# Altium project power-hub.prjpcb
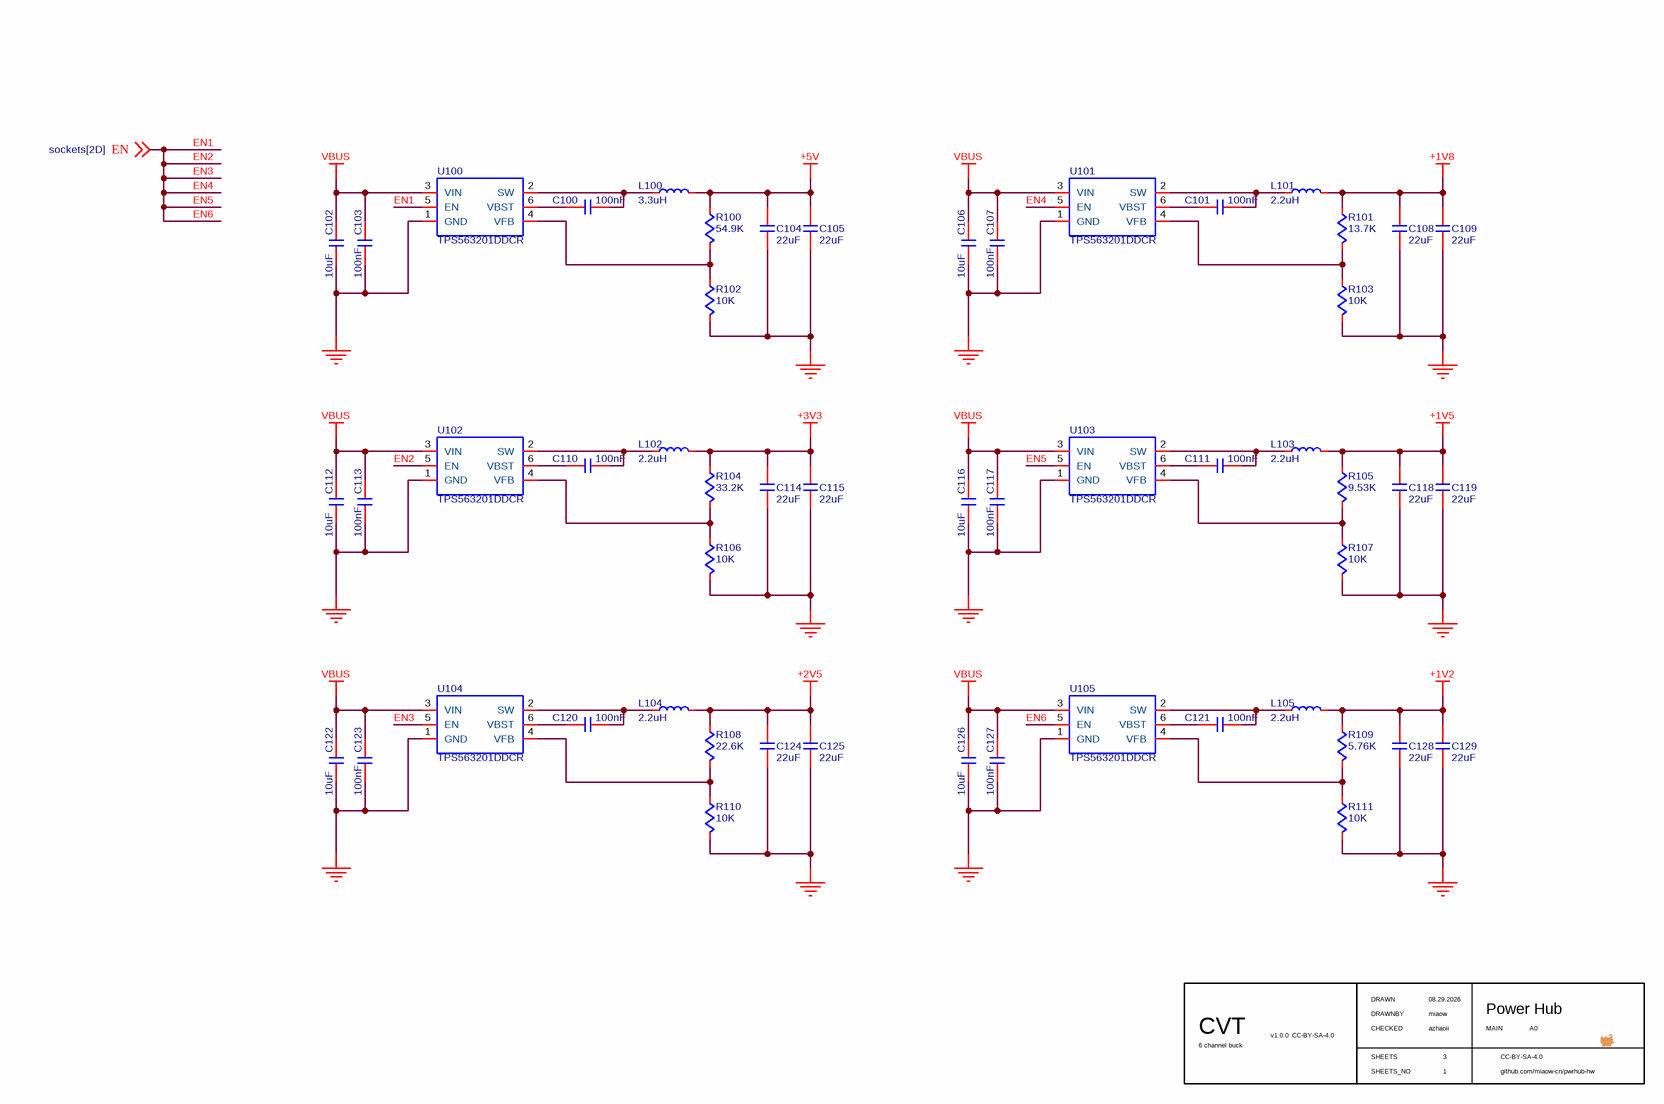
[diagram p0: converter.schdoc]
3 sheets, 85 parts. Net scope: global (net labels, ports and power ports of the same name join across sheets).
Board file: main.pcbdoc
Sheets:
  converter.schdoc
  sockets.schdoc
  misc.schdoc

## Sheet converter.schdoc: CVT
size A4; Date: 08.29.2026; CheckedBy: azhaoii; DrawnBy: miaow; Revision: v1.0.0; SheetNumber: 1; SheetTotal: 3; Sample: A0; Url: github.com/miaow-cn/pwrhub-hw; Liscense: CC-BY-SA-4.0; Board: Power Hub; BoardType: MAIN; Desc: 6 channel buck

### Parts
C100  value 100nF  [C0402]  (hidden comment: C-NOMO)
C101  value 100nF  [C0402]  (hidden comment: C-NOMO)
C102  value 10uF  [C0805]  (hidden comment: C-NOMO)
C103  value 100nF  [C0402]  (hidden comment: C-NOMO)
C104  value 22uF  [C0805]  (hidden comment: C-NOMO)
C105  value 22uF  [C0805]  (hidden comment: C-NOMO)
C106  value 10uF  [C0805]  (hidden comment: C-NOMO)
C107  value 100nF  [C0402]  (hidden comment: C-NOMO)
C108  value 22uF  [C0805]  (hidden comment: C-NOMO)
C109  value 22uF  [C0805]  (hidden comment: C-NOMO)
C110  value 100nF  [C0402]  (hidden comment: C-NOMO)
C111  value 100nF  [C0402]  (hidden comment: C-NOMO)
C112  value 10uF  [C0805]  (hidden comment: C-NOMO)
C113  value 100nF  [C0402]  (hidden comment: C-NOMO)
C114  value 22uF  [C0805]  (hidden comment: C-NOMO)
C115  value 22uF  [C0805]  (hidden comment: C-NOMO)
C116  value 10uF  [C0805]  (hidden comment: C-NOMO)
C117  value 100nF  [C0402]  (hidden comment: C-NOMO)
C118  value 22uF  [C0805]  (hidden comment: C-NOMO)
C119  value 22uF  [C0805]  (hidden comment: C-NOMO)
C120  value 100nF  [C0402]  (hidden comment: C-NOMO)
C121  value 100nF  [C0402]  (hidden comment: C-NOMO)
C122  value 10uF  [C0805]  (hidden comment: C-NOMO)
C123  value 100nF  [C0402]  (hidden comment: C-NOMO)
C124  value 22uF  [C0805]  (hidden comment: C-NOMO)
C125  value 22uF  [C0805]  (hidden comment: C-NOMO)
C126  value 10uF  [C0805]  (hidden comment: C-NOMO)
C127  value 100nF  [C0402]  (hidden comment: C-NOMO)
C128  value 22uF  [C0805]  (hidden comment: C-NOMO)
C129  value 22uF  [C0805]  (hidden comment: C-NOMO)
L100  value 3.3uH  [FXL0530]  (hidden comment: L)
L101  value 2.2uH  [FXL0420]  (hidden comment: L)
L102  value 2.2uH  [FXL0420]  (hidden comment: L)
L103  value 2.2uH  [FXL0420]  (hidden comment: L)
L104  value 2.2uH  [FXL0420]  (hidden comment: L)
L105  value 2.2uH  [FXL0420]  (hidden comment: L)
R100  value 54.9K  [R0402]  (hidden comment: R)
R101  value 13.7K  [R0402]  (hidden comment: R)
R102  value 10K  [R0402]  (hidden comment: R)
R103  value 10K  [R0402]  (hidden comment: R)
R104  value 33.2K  [R0402]  (hidden comment: R)
R105  value 9.53K  [R0402]  (hidden comment: R)
R106  value 10K  [R0402]  (hidden comment: R)
R107  value 10K  [R0402]  (hidden comment: R)
R108  value 22.6K  [R0402]  (hidden comment: R)
R109  value 5.76K  [R0402]  (hidden comment: R)
R110  value 10K  [R0402]  (hidden comment: R)
R111  value 10K  [R0402]  (hidden comment: R)
U100  TPS563201DDCR  [TPS563201DDCR]
U101  TPS563201DDCR  [TPS563201DDCR]
U102  TPS563201DDCR  [TPS563201DDCR]
U103  TPS563201DDCR  [TPS563201DDCR]
U104  TPS563201DDCR  [TPS563201DDCR]
U105  TPS563201DDCR  [TPS563201DDCR]

### Nets
+1V2: C128.2 C129.2 L105.2 R109.2
+1V5: C118.2 C119.2 L103.2 R105.2
+1V8: C108.2 C109.2 L101.2 R101.2
+2V5: C124.2 C125.2 L104.2 R108.2
+3V3: C114.2 C115.2 L102.2 R104.2
+5V: C104.2 C105.2 L100.2 R100.2
GND: C102.1 C103.1 C104.1 C105.1 C106.1 C107.1 C108.1 C109.1 C112.1 C113.1 C114.1 C115.1 C116.1 C117.1 C118.1 C119.1 C122.1 C123.1 C124.1 C125.1 C126.1 C127.1 C128.1 C129.1 R102.1 R103.1 R106.1 R107.1 R110.1 R111.1 U100.1(GND) U101.1(GND) U102.1(GND) U103.1(GND) U104.1(GND) U105.1(GND)
VBUS: C102.2 C103.2 C106.2 C107.2 C112.2 C113.2 C116.2 C117.2 C122.2 C123.2 C126.2 C127.2 U100.3(VIN) U101.3(VIN) U102.3(VIN) U103.3(VIN) U104.3(VIN) U105.3(VIN)
EN1: U100.5(EN) U101.5(EN) U102.5(EN) U103.5(EN) U104.5(EN) U105.5(EN) ; off-sheet EN  [also labelled EN, EN2, EN3, EN4, EN5, EN6]
NetC100_1: C100.1 U100.6(VBST)
NetC100_2: C100.2 L100.1 U100.2(SW)
NetC101_1: C101.1 U101.6(VBST)
NetC101_2: C101.2 L101.1 U101.2(SW)
NetC110_1: C110.1 U102.6(VBST)
NetC110_2: C110.2 L102.1 U102.2(SW)
NetC111_1: C111.1 U103.6(VBST)
NetC111_2: C111.2 L103.1 U103.2(SW)
NetC120_1: C120.1 U104.6(VBST)
NetC120_2: C120.2 L104.1 U104.2(SW)
NetC121_1: C121.1 U105.6(VBST)
NetC121_2: C121.2 L105.1 U105.2(SW)
NetR100_1: R100.1 R102.2 U100.4(VFB)
NetR101_1: R101.1 R103.2 U101.4(VFB)
NetR104_1: R104.1 R106.2 U102.4(VFB)
NetR105_1: R105.1 R107.2 U103.4(VFB)
NetR108_1: R108.1 R110.2 U104.4(VFB)
NetR109_1: R109.1 R111.2 U105.4(VFB)

### Notes on the sheet
- DRAWN
- CHECKED
- DRAWNBY
- SHEETS
- SHEETS_NO

### Library data of the parts
C100-C129 = C-NOMO: voltage: 25V; precision: 5%
L100-L105 = L: Code_IEC: 1005; Published: 8-Jun-2000; LatestRevisionDate: 29-May-2009; LatestRevisionNote: IPC-7351 Footprint Added.; PackageReference: 0402-A; Publisher: Altium Limited; PackageDescription: Chip Inductor; Code_JEITA: 0402; Supplier 1: LCSC
  L100: Supplier Part Number 1: C475518
  L101-L105: Supplier Part Number 1: C167206
R100-R111 = R: precision: 1%
U100-U105 = TPS563201DDCR: BUCK; Supplier 1: LCSC; Supplier Part Number 1: C116592

## Sheet sockets.schdoc: SCKT
size A4; Date: 08.29.2026; CheckedBy: azhaoii; DrawnBy: miaow; Revision: v1.0.0; SheetNumber: 2; SheetTotal: 3; Sample: A0; Url: github.com/miaow-cn/pwrhub-hw; Liscense: CC-BY-SA-4.0; Board: Power Hub; BoardType: MAIN; Desc: 6 channel buck
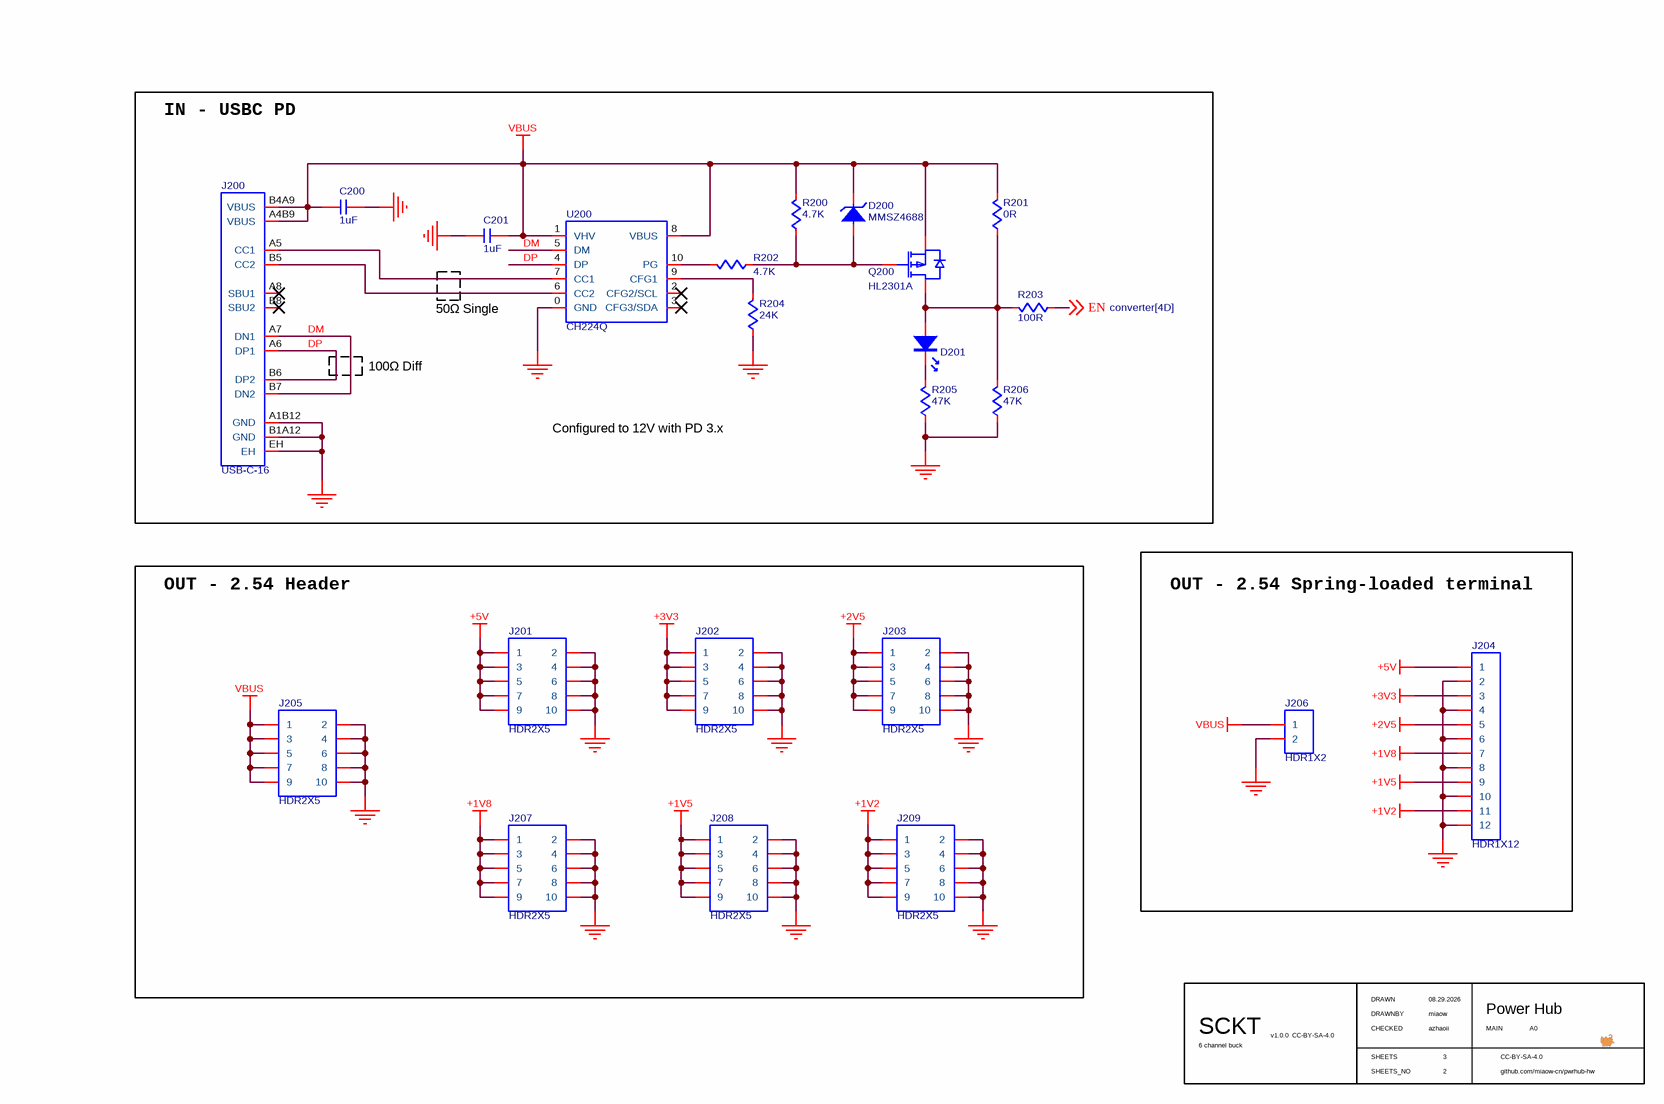
[diagram p1: sockets.schdoc]

### Parts
C200  value 1uF  [C0402]  (hidden comment: C-NOMO)
C201  value 1uF  [C0402]  (hidden comment: C-NOMO)
D200  MMSZ4688  [MMSZ4688]
D201  LED  [LED0603]  (value not drawn)
J200  USB-C-16  [USB-C-16]
J201  HDR2X5  [HDR2X5]
J202  HDR2X5  [HDR2X5]
J203  HDR2X5  [HDR2X5]
J204  HDR1X12  [KF141R-2.54-12P]
J205  HDR2X5  [HDR2X5]
J206  HDR1X2  [KF141R-2.54-2P]
J207  HDR2X5  [HDR2X5]
J208  HDR2X5  [HDR2X5]
J209  HDR2X5  [HDR2X5]
Q200  HL2301A  [HL2301A]
R200  value 4.7K  [R0402]  (hidden comment: R)
R201  value 0R  [R0402]  (hidden comment: R)
R202  value 4.7K  [R0402]  (hidden comment: R)
R203  value 100R  [R0402]  (hidden comment: R)
R204  value 24K  [R0402]  (hidden comment: R)
R205  value 47K  [R0402]  (hidden comment: R)
R206  value 47K  [R0402]  (hidden comment: R)
U200  CH224Q  [CH224Q]

### Blocks framed on the sheet
IN - USBC PD: C200 C201 D200 D201 J200 Q200 R200-R206 U200
OUT - 2.54 Spring-loaded terminal: J204 J206
OUT - 2.54 Header: J201-J203 J205 J207-J209

### Nets
+1V2: J204.11 J209.1 J209.3 J209.5 J209.7 J209.9
+1V5: J204.9 J208.1 J208.3 J208.5 J208.7 J208.9
+1V8: J204.7 J207.1 J207.3 J207.5 J207.7 J207.9
+2V5: J203.1 J203.3 J203.5 J203.7 J203.9 J204.5
+3V3: J202.1 J202.3 J202.5 J202.7 J202.9 J204.3
+5V: J201.1 J201.3 J201.5 J201.7 J201.9 J204.1
GND: C200.1 C201.1 J200.A1B12(GND) J200.B1A12(GND) J200.EH J201.2 J201.4 J201.6 J201.8 J201.10 J202.2 J202.4 J202.6 J202.8 J202.10 J203.2 J203.4 J203.6 J203.8 J203.10 J204.2 J204.4 J204.6 J204.8 J204.10 J204.12 J205.2 J205.4 J205.6 J205.8 J205.10 J206.2 J207.2 J207.4 J207.6 J207.8 J207.10 J208.2 J208.4 J208.6 J208.8 J208.10 J209.2 J209.4 J209.6 J209.8 J209.10 R204.2 R205.2 R206.2 U200.0(GND)
VBUS: C200.2 C201.2 D200.1(C) J200.A4B9(VBUS) J200.B4A9(VBUS) J205.1 J205.3 J205.5 J205.7 J205.9 J206.1 Q200.S R200.1 R201.1 U200.1(VHV) U200.8(VBUS)
DM: J200.A7(DN1) J200.B7(DN2) U200.5(DM)
DP: J200.A6(DP1) J200.B6(DP2) U200.4(DP)
EN: R203.2 ; off-sheet EN  [project net EN1]
NetD200_2: D200.2(A) Q200.G R200.2 R202.2
NetD201_1: D201.1 R205.1
NetD201_2: D201.2 Q200.D R201.2 R203.1 R206.1
NetJ200_A5: J200.A5(CC1) U200.7(CC1)
NetJ200_B5: J200.B5(CC2) U200.6(CC2)
NetR202_1: R202.1 U200.10(PG)
NetR204_1: R204.1 U200.9(CFG1)

Not connected (* = marked no-connect by the designer): J200 A8(SBU1)* B8(SBU2)*; U200 2(CFG2/SCL)* 3(CFG3/SDA)*

### Notes on the sheet
- 50Ω Single
- 100Ω Diff
- Configured to 12V with PD 3.x
- DRAWN
- CHECKED
- DRAWNBY
- SHEETS
- SHEETS_NO

### Library data of the parts
C200 C201 = C-NOMO: voltage: 25V; precision: 5%
D200 = MMSZ4688: ZENER; Supplier 1: LCSC; Supplier Part Number 1: C22395547
Q200 = HL2301A: PMOS; Supplier 1: LCSC; Supplier Part Number 1: C7420344
R200-R206 = R: precision: 1%
U200 = CH224Q: PD3.2; Supplier 1: LCSC; Supplier Part Number 1: C46061833
J200 = USB-C-16: Supplier 1: LCSC; Supplier Part Number 1: C165948
J201-J203 J205 J207-J209 = HDR2X5: Supplier 1: LCSC; Supplier 2: LCSC; Supplier Part Number 2: C5665; Supplier Part Number 3: C22392240; Supplier 3: LCSC; Supplier Part Number 4: C3975188; Supplier 4: LCSC; Supplier Part Number 1: C225520
J204 = HDR1X12: Supplier 1: LCSC; Supplier Part Number 1: C2840012; Supplier 2: LCSC; Supplier Part Number 2: C475133
J206 = HDR1X2: Supplier 1: LCSC; Supplier Part Number 1: C474881; Supplier 2: LCSC; Supplier Part Number 2: C225477; Supplier 3: LCSC; Supplier Part Number 3: C20079; Supplier 4: LCSC; Supplier Part Number 4: C475124

## Sheet misc.schdoc: MISC
size A4; Date: 08.29.2026; CheckedBy: azhaoii; DrawnBy: miaow; Revision: v1.0.0; SheetNumber: 3; SheetTotal: 3; Sample: A0; Url: github.com/miaow-cn/pwrhub-hw; Liscense: CC-BY-SA-4.0; Board: Power Hub; BoardType: MAIN; Desc: miscellaneous
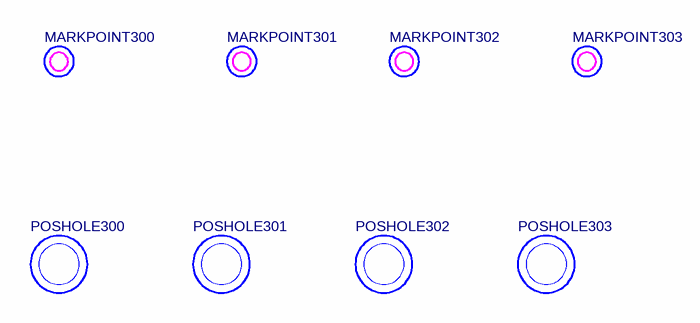
[diagram p2: misc.schdoc]

### Parts
MARKPOINT300  MARKPOINT  [MARKPOINT-1.0]  (value not drawn)
MARKPOINT301  MARKPOINT  [MARKPOINT-1.0]  (value not drawn)
MARKPOINT302  MARKPOINT  [MARKPOINT-1.0]  (value not drawn)
MARKPOINT303  MARKPOINT  [MARKPOINT-1.0]  (value not drawn)
POSHOLE300  POSHOLE  [POSHOLE-3.2]  (value not drawn)
POSHOLE301  POSHOLE  [POSHOLE-3.2]  (value not drawn)
POSHOLE302  POSHOLE  [POSHOLE-3.2]  (value not drawn)
POSHOLE303  POSHOLE  [POSHOLE-3.2]  (value not drawn)

### Notes on the sheet
- DRAWN
- CHECKED
- DRAWNBY
- SHEETS
- SHEETS_NO

## Nets that join several sheets
+1V2: converter (C128.2 C129.2 L105.2 R109.2), sockets (6 pins)
+1V5: converter (C118.2 C119.2 L103.2 R105.2), sockets (6 pins)
+1V8: converter (C108.2 C109.2 L101.2 R101.2), sockets (6 pins)
+2V5: converter (C124.2 C125.2 L104.2 R108.2), sockets (6 pins)
+3V3: converter (C114.2 C115.2 L102.2 R104.2), sockets (6 pins)
+5V: converter (C104.2 C105.2 L100.2 R100.2), sockets (6 pins)
GND: converter (36 pins), sockets (51 pins)
VBUS: converter (18 pins), sockets (16 pins)
EN1: converter (6 pins), sockets (R203.2)

## Assembly variants
main: not fitted R201